# Altium schematic sheet Pressure, GPS, Temp Sensors.SchDoc
size A2
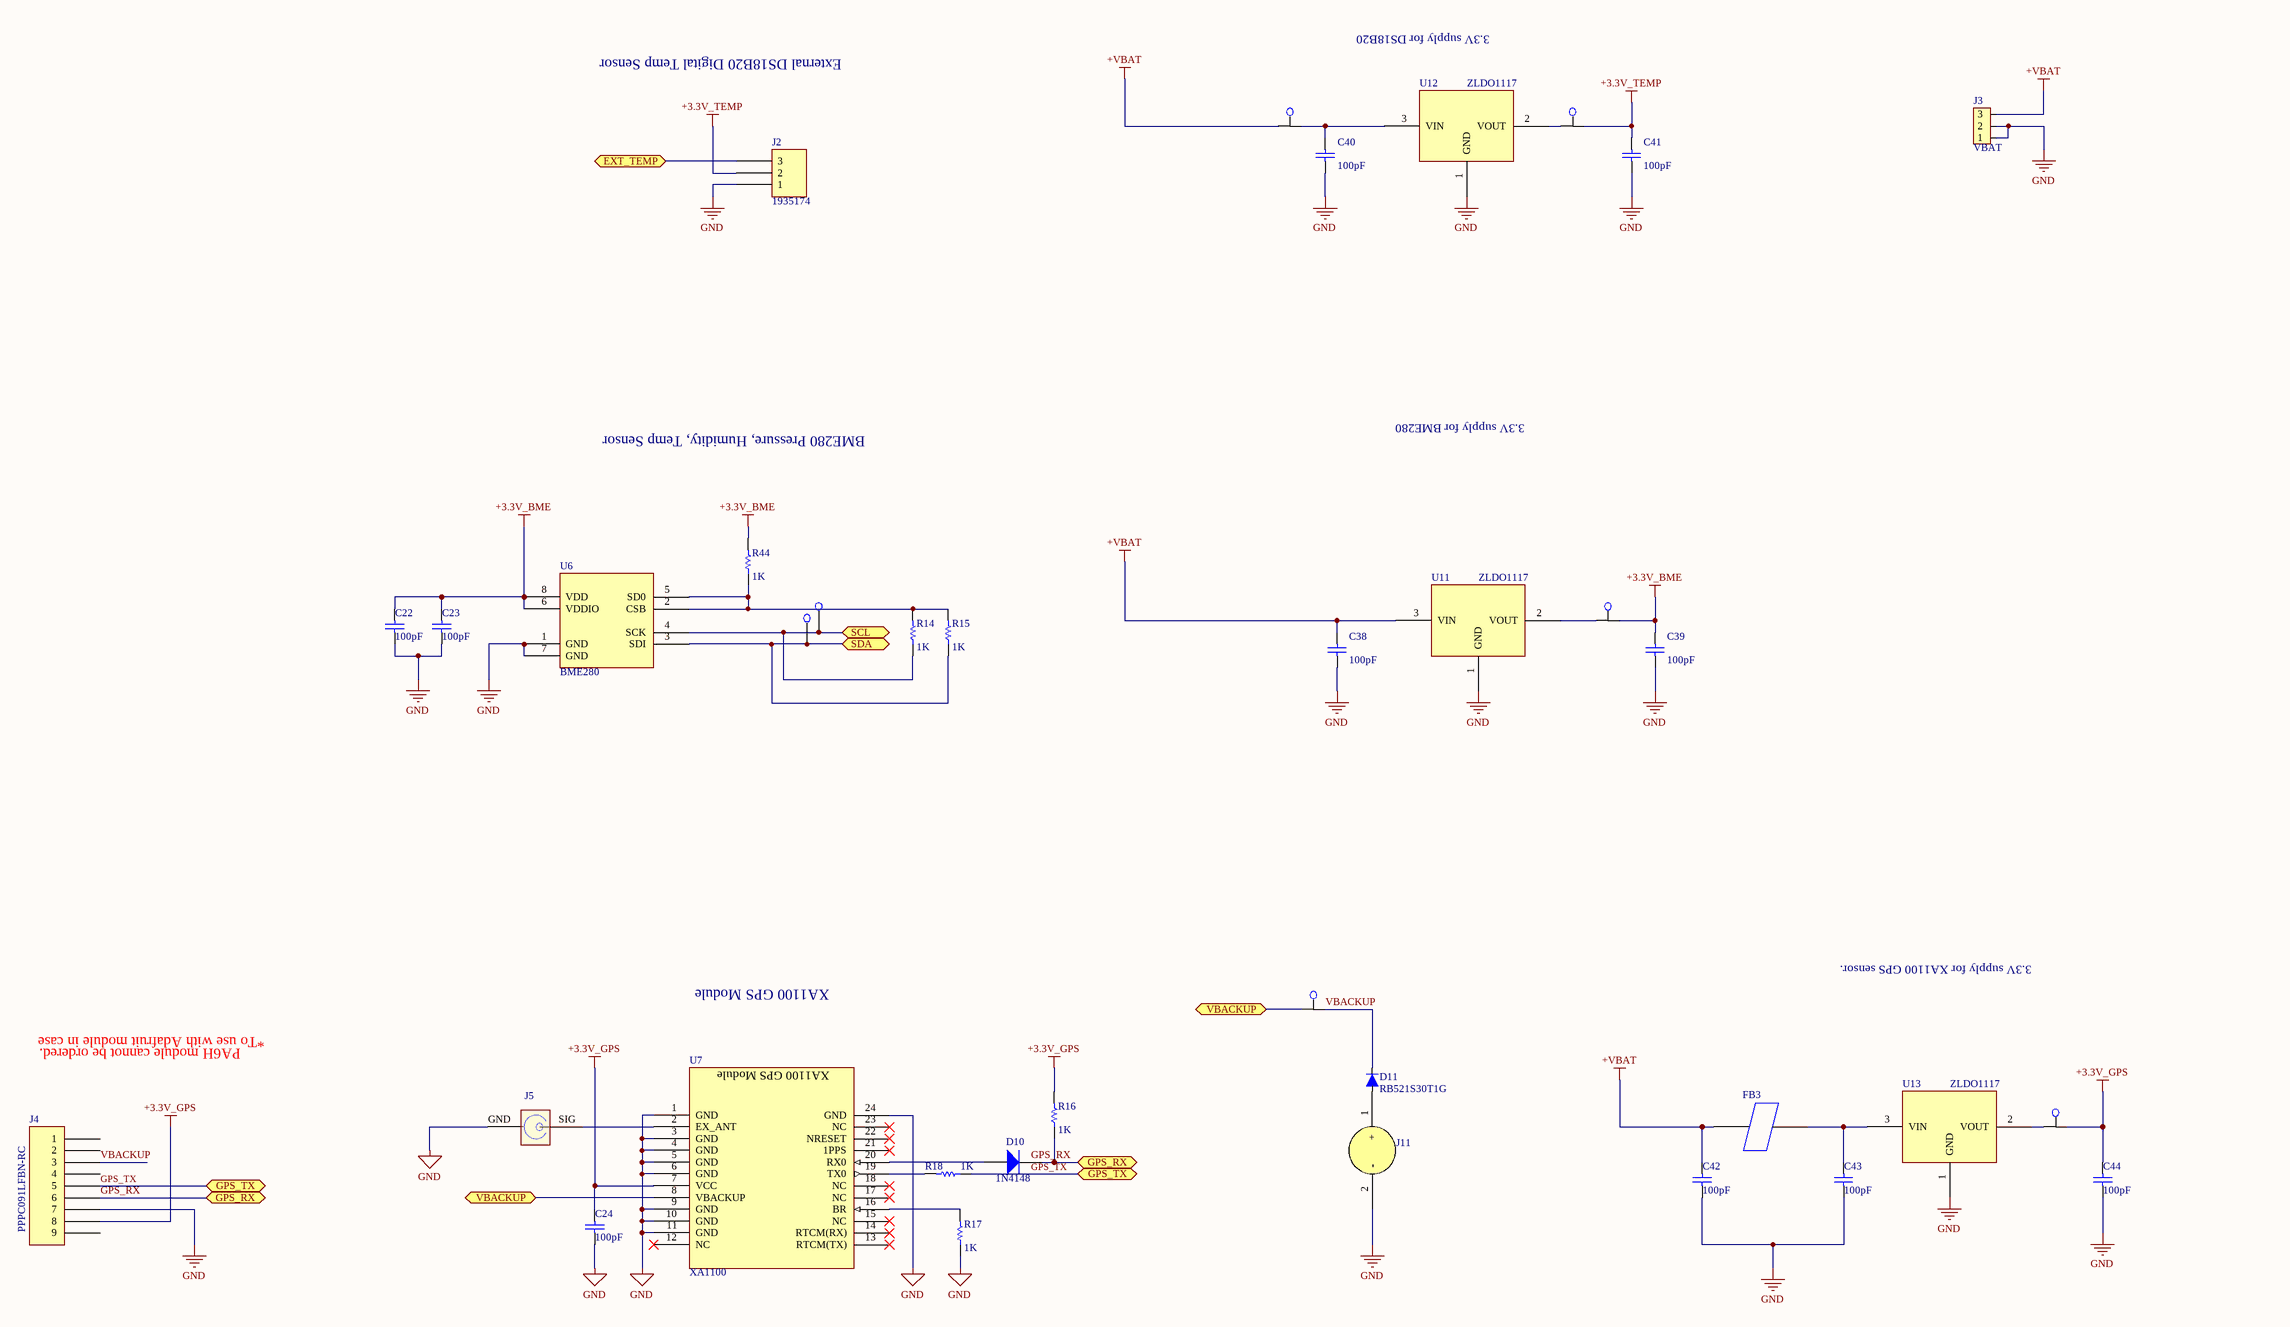
[diagram p0: Pressure, GPS, Temp Sensors.SchDoc]

## Parts
C22  value 100pF  [1608[0603]]  (hidden comment: Cap)
C23  value 100pF  [1608[0603]]  (hidden comment: Cap)
C24  value 100pF  [1608[0603]]  (hidden comment: Cap)
C38  value 100pF  [1608[0603]]  (hidden comment: Cap)
C39  value 100pF  [1608[0603]]  (hidden comment: Cap)
C40  value 100pF  [1608[0603]]  (hidden comment: Cap)
C41  value 100pF  [1608[0603]]  (hidden comment: Cap)
C42  value 100pF  [1608[0603]]  (hidden comment: Cap)
C43  value 100pF  [1608[0603]]  (hidden comment: Cap)
C44  value 100pF  [1608[0603]]  (hidden comment: Cap)
D10  1N4148  [SOD-123 1N4148W-7-F]
D11  RB521S30T1G  [SOD-523 RB521S30]
FB3  Ferrite Bead  [MI0805K400R-10]  (value not drawn)
J2  1935174  [1935174]
J3  VBAT  [6410/3pin]
J4  PPPC091LFBN-RC  [PPPC091LFBN-RC]
J5  uFl Connector  [CONUFL001-SMD-T]  (value not drawn)
J11  301 30mm Holder  [S8201-46R]  (value not drawn)
R14  value 1K  [6-0805_N]  (hidden comment: Res1)
R15  value 1K  [6-0805_N]  (hidden comment: Res1)
R16  value 1K  [6-0805_N]  (hidden comment: Res1)
R17  value 1K  [6-0805_N]  (hidden comment: Res1)
R18  value 1K  [6-0805_N]  (hidden comment: Res1)
R44  value 1K  [6-0805_N]  (hidden comment: Res1)
TP1  SMD Compact Test Point  [5029 Test Point]  (value not drawn)
TP2  SMD Compact Test Point  [5029 Test Point]  (value not drawn)
TP3  Hook Type Test Point  [36-500x-ND]  (value not drawn)
TP17  Hook Type Test Point  [36-500x-ND]  (value not drawn)
TP18  Hook Type Test Point  [36-500x-ND]  (value not drawn)
TP19  Hook Type Test Point  [36-500x-ND]  (value not drawn)
TP21  Hook Type Test Point  [36-500x-ND]  (value not drawn)
U6  BME280  [LGA8C65P4X4_250X250X100]
U7  XA1100  [XA1100]
U11  ZLDO1117  [SOT230P700X165-4N]
U12  ZLDO1117  [SOT230P700X165-4N]
U13  ZLDO1117  [SOT230P700X165-4N]

## Ports
EXT_TEMP, GPS_RX, GPS_TX, SCL, SDA, VBACKUP

## Nets
+3.3V_BME: C22.2 C23.2 C39.1 R44.2 TP17.2 U6.6(VDDIO) U6.8(VDD)
+3.3V_GPS: C24.2 C44.2 J4.8 R16.2 TP21.2 U7.7(VCC)
+3.3V_TEMP: C41.1 J2.2 TP19.2
+VBAT: C38.2 C42.2 FB3.1 J3.3 TP18.1 U11.3(VIN)
GND: C22.1 C23.1 C24.1 C38.1 C39.2 C40.1 C41.2 C42.1 C43.1 C44.1 J2.1 J3.1 J3.2 J4.7 J5.GND J11.2(-) R17.1 U6.1(GND) U6.7(GND) U7.1(GND) U7.3(GND) U7.4(GND) U7.5(GND) U7.6(GND) U7.9(GND) U7.10(GND) U7.11(GND) U7.24(GND) U11.1(GND) U12.1(GND) U13.1(GND)
EXT_TEMP: J2.3 ; port EXT_TEMP
GPS_RX: D10.2(K) J4.6 R16.1 ; port GPS_RX
GPS_TX: J4.5 R18.1 ; port GPS_TX
SCL: R14.1 TP1.1 U6.4(SCK) ; port SCL
SDA: R15.1 TP2.1 U6.3(SDI) ; port SDA
VBACKUP: D11.1(CATHODE) J4.3 TP3.2
VBACKUP: TP3.1 U7.8(VBACKUP) ; port VBACKUP  [a separate net that carries the same name]
NetC40_2: C40.2 TP18.2 U12.3(VIN)
NetC43_2: C43.2 FB3.2 U13.3(VIN)
NetD10_1: D10.1(A) U7.20(RX0)
NetD11_2: D11.2(ANODE) J11.1(+)
NetJ5_SIG: J5.SIG U7.2(EX_ANT)
NetR14_2: R14.2 R15.2 R44.1 U6.2(CSB) U6.5(SD0)
NetR17_2: R17.2 U7.16(BR)
NetR18_2: R18.2 U7.19(TX0)
NetTP17_1: TP17.1 U11.2(VOUT)
NetTP19_1: TP19.1 U12.2(VOUT)
NetTP21_1: TP21.1 U13.2(VOUT)

Not connected (* = marked no-connect by the designer): J4 1 2 4 9; U7 12(NC)* 13(RTCM(TX))* 14(RTCM(RX))* 15(NC)* 17(NC)* 18(NC)* 21(1PPS)* 22(NRESET)* 23(NC)*

## Notes on the sheet
- 3.3V supply for DS18B20
- External DS18B20 Digital Temp Sensor
- BME280 Pressure, Humidity, Temp Sensor
- 3.3V supply for BME280
- XA1100 GPS Module
- 3.3V supply for XA1100 GPS sensor.
- PA6H module cannot be ordered.
- *To use with Adafruit module in case
- Labels drawn without touching a wire or pin: GPS_RX
- (in symbol XA1100) XA1100 GPS Module

## Library data of the parts
C22-C24 C38-C44 = Cap: Capacitor; Published: 8-Jun-2000; LatestRevisionDate: 17-Jul-2002; LatestRevisionNote: Re-released for DXP Platform.; PackageReference: RAD-0.3; Publisher: Altium Limited; PackageDescription: Radial Cap, Thru-Hole; 2 Leads; 0.3 in Pin Spacing
D10 = Diode 1N4148: High Conductance Fast Diode; Supplier Link: 1N4148W-FDICT-ND
D11 = RB521S30T1G Shottky Diode: Supplier Link: RB521S30T1GOSCT-ND
FB3 = Ferrite Bead: MI0805K400R-10; Supplier Link: 240-2389-1-ND
J2 = 1935174: 3-pin Terminal Block; Supplier Link: 277-1578-ND
J3 = CON3: Connector 3 pin; Value: *; Type: *; Mfg.: *; Supplier: *; Part#: *; Price: *; Notes: *
J4 = CON9: 9-pin 0.100" Female Header; Supplier Link: S7042-ND
J5 = uFl Connector: CONUFL001-SMD-T; Supplier Link: CONUFL001-SMD-TCT-ND
J11 = Coin Cell Holder: 301 30mm Coin Cell Holder; Supplier Link: 36-301-ND
R14-R18 R44 = Res1: Resistor; Published: 8-Jun-2000; LatestRevisionDate: 17-Jul-2002; LatestRevisionNote: Re-released for DXP Platform.; PackageReference: AXIAL-0.3; Publisher: Altium Limited; PackageDescription: Axial Device, Thru-Hole; 2 Leads; 0.3 in Pin Spacing
U6 = BME280: Digital Environmental Sensor; Supplier Link: 828-1063-1-ND
U7 = XA1100: GPS Module; Supplier Link: 1645-1094-1-ND
U11-U13 = ZLDO1117: Linear Regulator 1A; Supplier Link: ZLDO1117G50DICT-ND
TP3 TP17-TP19 TP21 = Hook Type Test Point: Supplier Link: 36-500x-ND